# Altium schematic sheet Top_domain.SchDoc
size 152 x 114 mm; SheetNumber: 1; SheetTotal: 5
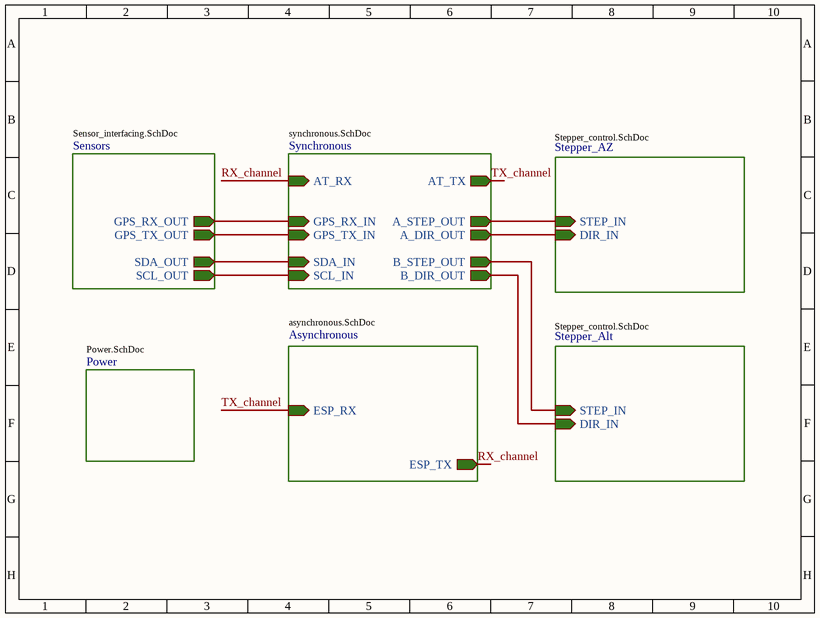
[diagram p0: Top_domain.SchDoc]

## Sub-sheets
Asynchronous = asynchronous.SchDoc: ESP_RX (in), ESP_TX (out)
Power = Power.SchDoc: no entries
Sensors = Sensor_interfacing.SchDoc: GPS_RX_OUT (out), GPS_TX_OUT (out), SDA_OUT (out), SCL_OUT (out)
Stepper_Alt = Stepper_control.SchDoc: STEP_IN (in), DIR_IN (in)
Stepper_AZ = Stepper_control.SchDoc: STEP_IN (in), DIR_IN (in)
Synchronous = synchronous.SchDoc: AT_TX (out), AT_RX (in), GPS_RX_IN (in), GPS_TX_IN (in), SDA_IN (in), SCL_IN (in), A_STEP_OUT (out), B_STEP_OUT (out), A_DIR_OUT (out), B_DIR_OUT (out)

## Nets
RX_channel: sheet Synchronous/AT_RX, sheet Asynchronous/ESP_TX
TX_channel: sheet Synchronous/AT_TX, sheet Asynchronous/ESP_RX
(unnamed): sheet Synchronous/GPS_RX_IN, sheet Sensors/GPS_RX_OUT
(unnamed): sheet Synchronous/GPS_TX_IN, sheet Sensors/GPS_TX_OUT
(unnamed): sheet Synchronous/SDA_IN, sheet Sensors/SDA_OUT
(unnamed): sheet Synchronous/SCL_IN, sheet Sensors/SCL_OUT
(unnamed): sheet Synchronous/A_STEP_OUT, sheet Stepper_AZ/STEP_IN
(unnamed): sheet Synchronous/B_STEP_OUT, sheet Stepper_Alt/STEP_IN
(unnamed): sheet Synchronous/A_DIR_OUT, sheet Stepper_AZ/DIR_IN
(unnamed): sheet Synchronous/B_DIR_OUT, sheet Stepper_Alt/DIR_IN